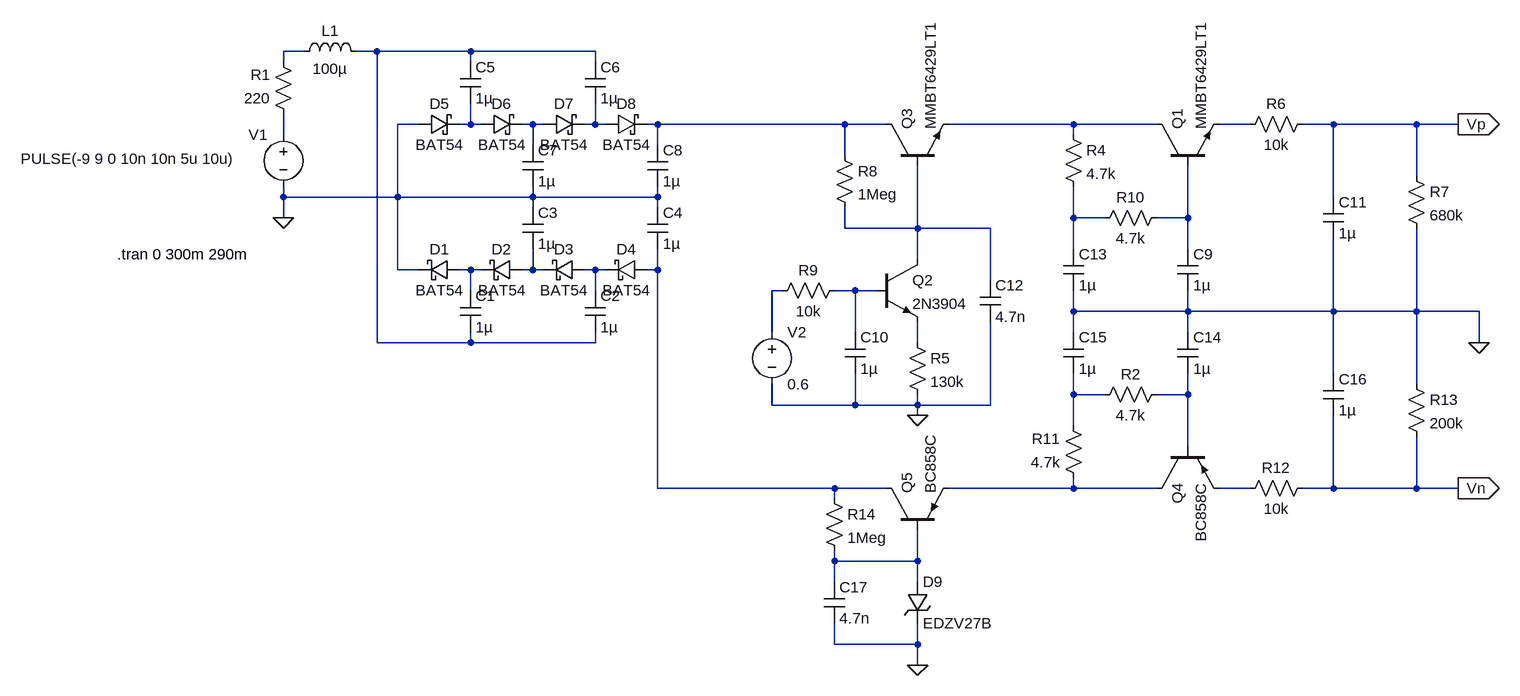
[diagram p0: schematic bias_gen_parasitics.asc]
bias_gen_parasitics.asc, the LTspice schematic file:
Version 4
SHEET 1 1868 680
WIRE -112 -704 -144 -704
WIRE 0 -704 -32 -704
WIRE 144 -704 0 -704
WIRE 336 -704 144 -704
WIRE -144 -688 -144 -704
WIRE 144 -688 144 -704
WIRE 336 -688 336 -704
WIRE 64 -592 32 -592
WIRE 144 -592 144 -624
WIRE 144 -592 128 -592
WIRE 160 -592 144 -592
WIRE 240 -592 224 -592
WIRE 256 -592 240 -592
WIRE 336 -592 336 -624
WIRE 336 -592 320 -592
WIRE 352 -592 336 -592
WIRE 432 -592 416 -592
WIRE 720 -592 432 -592
WIRE 784 -592 720 -592
WIRE 1072 -592 880 -592
WIRE 1200 -592 1072 -592
WIRE 1344 -592 1296 -592
WIRE 1472 -592 1424 -592
WIRE 1600 -592 1472 -592
WIRE 1664 -592 1600 -592
WIRE -144 -576 -144 -608
WIRE 1072 -576 1072 -592
WIRE 240 -560 240 -592
WIRE 432 -560 432 -592
WIRE 720 -544 720 -592
WIRE 1600 -512 1600 -592
WIRE -144 -480 -144 -496
WIRE 32 -480 32 -592
WIRE 32 -480 -144 -480
WIRE 240 -480 240 -496
WIRE 240 -480 32 -480
WIRE 432 -480 432 -496
WIRE 432 -480 240 -480
WIRE 1472 -480 1472 -592
WIRE 240 -464 240 -480
WIRE 432 -464 432 -480
WIRE -144 -448 -144 -480
WIRE 1072 -448 1072 -496
WIRE 1120 -448 1072 -448
WIRE 1248 -448 1248 -528
WIRE 1248 -448 1200 -448
WIRE 720 -432 720 -464
WIRE 832 -432 832 -528
WIRE 832 -432 720 -432
WIRE 944 -432 832 -432
WIRE 1072 -400 1072 -448
WIRE 1248 -400 1248 -448
WIRE 832 -384 832 -432
WIRE 32 -368 32 -480
WIRE 64 -368 32 -368
WIRE 144 -368 128 -368
WIRE 160 -368 144 -368
WIRE 240 -368 240 -400
WIRE 240 -368 224 -368
WIRE 256 -368 240 -368
WIRE 336 -368 320 -368
WIRE 352 -368 336 -368
WIRE 432 -368 432 -400
WIRE 432 -368 416 -368
WIRE 944 -352 944 -432
WIRE 144 -336 144 -368
WIRE 336 -336 336 -368
WIRE 624 -336 608 -336
WIRE 736 -336 704 -336
WIRE 768 -336 736 -336
WIRE 1072 -304 1072 -336
WIRE 1248 -304 1248 -336
WIRE 1248 -304 1072 -304
WIRE 1472 -304 1472 -416
WIRE 1472 -304 1248 -304
WIRE 1600 -304 1600 -432
WIRE 1600 -304 1472 -304
WIRE 1696 -304 1600 -304
WIRE 608 -272 608 -336
WIRE 736 -272 736 -336
WIRE 1072 -272 1072 -304
WIRE 1248 -272 1248 -304
WIRE 0 -256 0 -704
WIRE 144 -256 144 -272
WIRE 144 -256 0 -256
WIRE 336 -256 336 -272
WIRE 336 -256 144 -256
WIRE 832 -256 832 -288
WIRE 1696 -256 1696 -304
WIRE 1472 -208 1472 -304
WIRE 1600 -192 1600 -304
WIRE 1072 -176 1072 -208
WIRE 1120 -176 1072 -176
WIRE 1248 -176 1248 -208
WIRE 1248 -176 1200 -176
WIRE 608 -160 608 -192
WIRE 736 -160 736 -208
WIRE 736 -160 608 -160
WIRE 832 -160 832 -176
WIRE 832 -160 736 -160
WIRE 944 -160 944 -288
WIRE 944 -160 832 -160
WIRE 832 -144 832 -160
WIRE 1072 -128 1072 -176
WIRE 1248 -96 1248 -176
WIRE 432 -32 432 -368
WIRE 704 -32 432 -32
WIRE 784 -32 704 -32
WIRE 1072 -32 1072 -48
WIRE 1072 -32 880 -32
WIRE 1200 -32 1072 -32
WIRE 1344 -32 1296 -32
WIRE 1472 -32 1472 -144
WIRE 1472 -32 1424 -32
WIRE 1600 -32 1600 -112
WIRE 1600 -32 1472 -32
WIRE 1664 -32 1600 -32
WIRE 704 -16 704 -32
WIRE 704 80 704 64
WIRE 832 80 832 32
WIRE 832 80 704 80
WIRE 704 112 704 80
WIRE 832 112 832 80
WIRE 704 208 704 176
WIRE 832 208 832 176
WIRE 832 208 704 208
WIRE 832 240 832 208
FLAG -144 -448 0
FLAG 1696 -256 0
FLAG 832 -144 0
FLAG 832 240 0
FLAG 1664 -592 Vp
IOPIN 1664 -592 Out
FLAG 1664 -32 Vn
IOPIN 1664 -32 Out
SYMBOL schottky 128 -352 M270
WINDOW 0 32 32 VTop 2
WINDOW 3 0 32 VBottom 2
SYMATTR InstName D1
SYMATTR Value BAT54
SYMATTR Description Diode
SYMATTR Type diode
SYMBOL schottky 224 -352 M270
WINDOW 0 32 32 VTop 2
WINDOW 3 0 32 VBottom 2
SYMATTR InstName D2
SYMATTR Value BAT54
SYMATTR Description Diode
SYMATTR Type diode
SYMBOL schottky 320 -352 M270
WINDOW 0 32 32 VTop 2
WINDOW 3 0 32 VBottom 2
SYMATTR InstName D3
SYMATTR Value BAT54
SYMATTR Description Diode
SYMATTR Type diode
SYMBOL schottky 416 -352 M270
WINDOW 0 32 32 VTop 2
WINDOW 3 0 32 VBottom 2
SYMATTR InstName D4
SYMATTR Value BAT54
SYMATTR Description Diode
SYMATTR Type diode
SYMBOL cap 128 -272 M180
WINDOW 0 24 56 Left 2
WINDOW 3 24 8 Left 2
SYMATTR InstName C1
SYMATTR Value 1µ
SYMATTR SpiceLine Rser=1 Lser=20n
SYMBOL cap 320 -272 M180
WINDOW 0 24 56 Left 2
WINDOW 3 24 8 Left 2
SYMATTR InstName C2
SYMATTR Value 1µ
SYMATTR SpiceLine Rser=1 Lser=20n
SYMBOL cap 224 -400 M180
WINDOW 0 24 56 Left 2
WINDOW 3 24 8 Left 2
SYMATTR InstName C3
SYMATTR Value 1µ
SYMATTR SpiceLine Rser=1 Lser=20n
SYMBOL cap 416 -400 M180
WINDOW 0 24 56 Left 2
WINDOW 3 24 8 Left 2
SYMATTR InstName C4
SYMATTR Value 1µ
SYMATTR SpiceLine Rser=1 Lser=20n
SYMBOL voltage -144 -592 M0
WINDOW 3 72 53 Left 2
WINDOW 123 0 0 Left 2
WINDOW 39 0 0 Left 2
SYMATTR Value PULSE(-9 9 0 10n 10n 5u 10u)
SYMATTR InstName V1
SYMBOL schottky 64 -576 R270
WINDOW 0 32 32 VTop 2
WINDOW 3 0 32 VBottom 2
SYMATTR InstName D5
SYMATTR Value BAT54
SYMATTR Description Diode
SYMATTR Type diode
SYMBOL schottky 160 -576 R270
WINDOW 0 32 32 VTop 2
WINDOW 3 0 32 VBottom 2
SYMATTR InstName D6
SYMATTR Value BAT54
SYMATTR Description Diode
SYMATTR Type diode
SYMBOL schottky 256 -576 R270
WINDOW 0 32 32 VTop 2
WINDOW 3 0 32 VBottom 2
SYMATTR InstName D7
SYMATTR Value BAT54
SYMATTR Description Diode
SYMATTR Type diode
SYMBOL schottky 352 -576 R270
WINDOW 0 32 32 VTop 2
WINDOW 3 0 32 VBottom 2
SYMATTR InstName D8
SYMATTR Value BAT54
SYMATTR Description Diode
SYMATTR Type diode
SYMBOL cap 128 -688 R0
SYMATTR InstName C5
SYMATTR Value 1µ
SYMATTR SpiceLine Rser=1 Lser=20n
SYMBOL cap 320 -688 R0
SYMATTR InstName C6
SYMATTR Value 1µ
SYMATTR SpiceLine Rser=1 Lser=20n
SYMBOL cap 224 -560 R0
SYMATTR InstName C7
SYMATTR Value 1µ
SYMATTR SpiceLine Rser=1 Lser=20n
SYMBOL cap 416 -560 R0
SYMATTR InstName C8
SYMATTR Value 1µ
SYMATTR SpiceLine Rser=1 Lser=20n
SYMBOL npn 1200 -528 R270
SYMATTR InstName Q1
SYMATTR Value MMBT6429LT1
SYMBOL res 1056 -592 R0
SYMATTR InstName R4
SYMATTR Value 4.7k
SYMBOL res 1328 -576 R270
WINDOW 0 32 56 VTop 2
WINDOW 3 0 56 VBottom 2
SYMATTR InstName R6
SYMATTR Value 10k
SYMBOL cap 1232 -400 R0
SYMATTR InstName C9
SYMATTR Value 1µ
SYMATTR SpiceLine Rser=1 Lser=20n
SYMBOL cap 1456 -480 R0
SYMATTR InstName C11
SYMATTR Value 1µ
SYMATTR SpiceLine Rser=1
SYMBOL res 1584 -528 R0
SYMATTR InstName R7
SYMATTR Value 680k
SYMBOL npn 768 -384 R0
SYMATTR InstName Q2
SYMATTR Value 2N3904
SYMBOL res 704 -560 R0
SYMATTR InstName R8
SYMATTR Value 1Meg
SYMBOL npn 784 -528 R270
SYMATTR InstName Q3
SYMATTR Value MMBT6429LT1
SYMBOL voltage 608 -288 R0
WINDOW 123 0 0 Left 0
WINDOW 39 0 0 Left 0
SYMATTR InstName V2
SYMATTR Value 0.6
SYMBOL cap 928 -352 R0
SYMATTR InstName C12
SYMATTR Value 4.7n
SYMATTR SpiceLine Rser=0.1 Lser=10n
SYMBOL res 816 -272 R0
SYMATTR InstName R5
SYMATTR Value 130k
SYMBOL res 720 -352 R90
WINDOW 0 0 56 VBottom 2
WINDOW 3 32 56 VTop 2
SYMATTR InstName R9
SYMATTR Value 10k
SYMBOL cap 720 -272 R0
SYMATTR InstName C10
SYMATTR Value 1µ
SYMATTR SpiceLine Rser=1 Lser=20n
SYMBOL cap 1056 -400 R0
SYMATTR InstName C13
SYMATTR Value 1µ
SYMATTR SpiceLine Rser=1 Lser=20n
SYMBOL res 1216 -464 R90
WINDOW 0 0 56 VBottom 2
WINDOW 3 32 56 VTop 2
SYMATTR InstName R10
SYMATTR Value 4.7k
SYMBOL pnp 1200 -96 M90
SYMATTR InstName Q4
SYMATTR Value BC858C
SYMBOL res 1216 -192 R90
WINDOW 0 0 56 VBottom 2
WINDOW 3 32 56 VTop 2
SYMATTR InstName R2
SYMATTR Value 4.7k
SYMBOL res 1088 -32 R180
WINDOW 0 36 76 Left 2
WINDOW 3 36 40 Left 2
SYMATTR InstName R11
SYMATTR Value 4.7k
SYMBOL res 1328 -16 R270
WINDOW 0 32 56 VTop 2
WINDOW 3 0 56 VBottom 2
SYMATTR InstName R12
SYMATTR Value 10k
SYMBOL cap 1232 -272 R0
SYMATTR InstName C14
SYMATTR Value 1µ
SYMATTR SpiceLine Rser=1 Lser=20n
SYMBOL cap 1056 -272 R0
SYMATTR InstName C15
SYMATTR Value 1µ
SYMATTR SpiceLine Rser=1 Lser=20n
SYMBOL cap 1456 -208 R0
SYMATTR InstName C16
SYMATTR Value 1µ
SYMATTR SpiceLine Rser=1
SYMBOL res 1584 -208 R0
SYMATTR InstName R13
SYMATTR Value 200k
SYMBOL res 688 -32 R0
SYMATTR InstName R14
SYMATTR Value 1Meg
SYMBOL zener 816 112 R0
SYMATTR InstName D9
SYMATTR Value EDZV27B
SYMATTR Description Diode
SYMATTR Type diode
SYMBOL pnp 784 32 R270
SYMATTR InstName Q5
SYMATTR Value BC858C
SYMBOL cap 688 112 R0
SYMATTR InstName C17
SYMATTR Value 4.7n
SYMATTR SpiceLine Rser=0.1 Lser=10n
SYMBOL res -128 -592 R180
WINDOW 0 36 76 Left 2
WINDOW 3 36 40 Left 2
SYMATTR InstName R1
SYMATTR Value 220
SYMBOL ind -128 -688 R270
WINDOW 0 32 56 VTop 2
WINDOW 3 5 56 VBottom 2
SYMATTR InstName L1
SYMATTR Value 100µ
TEXT -400 -392 Left 2 !.tran 0 300m 290m

The netlist it stands for:
* bias_gen_parasitics.asc
D1 N013 0 BAT54
D2 N014 N013 BAT54
D3 N015 N014 BAT54
D4 N016 N015 BAT54
C1 N002 N013 1µ Rser=1 Lser=20n
C2 N002 N015 1µ Rser=1 Lser=20n
C3 N014 0 1µ Rser=1 Lser=20n
C4 N016 0 1µ Rser=1 Lser=20n
V1 N009 0 PULSE(-9 9 0 10n 10n 5u 10u)
D5 0 N003 BAT54
D6 N003 N004 BAT54
D7 N004 N005 BAT54
D8 N005 N006 BAT54
C5 N002 N003 1µ Rser=1 Lser=20n
C6 N002 N005 1µ Rser=1 Lser=20n
C7 N004 0 1µ Rser=1 Lser=20n
C8 N006 0 1µ Rser=1 Lser=20n
Q1 N007 N011 N008 0 MMBT6429LT1
R4 N007 N010 4.7k
R6 N008 Vp 10k
C9 N011 0 1µ Rser=1 Lser=20n
C11 Vp 0 1µ Rser=1
R7 Vp 0 680k
Q2 N012 N018 N019 0 2N3904
R8 N006 N012 1Meg
Q3 N006 N012 N007 0 MMBT6429LT1
V2 N017 0 0.6
C12 N012 0 4.7n Rser=0.1 Lser=10n
R5 N019 0 130k
R9 N018 N017 10k
C10 N018 0 1µ Rser=1 Lser=20n
C13 N010 0 1µ Rser=1 Lser=20n
R10 N011 N010 4.7k
Q4 N022 N021 N023 0 BC858C
R2 N021 N020 4.7k
R11 N022 N020 4.7k
R12 N023 Vn 10k
C14 0 N021 1µ Rser=1 Lser=20n
C15 0 N020 1µ Rser=1 Lser=20n
C16 0 Vn 1µ Rser=1
R13 0 Vn 200k
R14 N016 N024 1Meg
D9 N024 0 EDZV27B
Q5 N016 N024 N022 0 BC858C
C17 N024 0 4.7n Rser=0.1 Lser=10n
R1 N009 N001 220
L1 N001 N002 100µ
.model D D
.lib standard.dio
.model NPN NPN
.model PNP PNP
.lib standard.bjt
.tran 0 300m 290m
.backanno
.end